# EAGLE schematic boat1 (EAGLE 6.4)
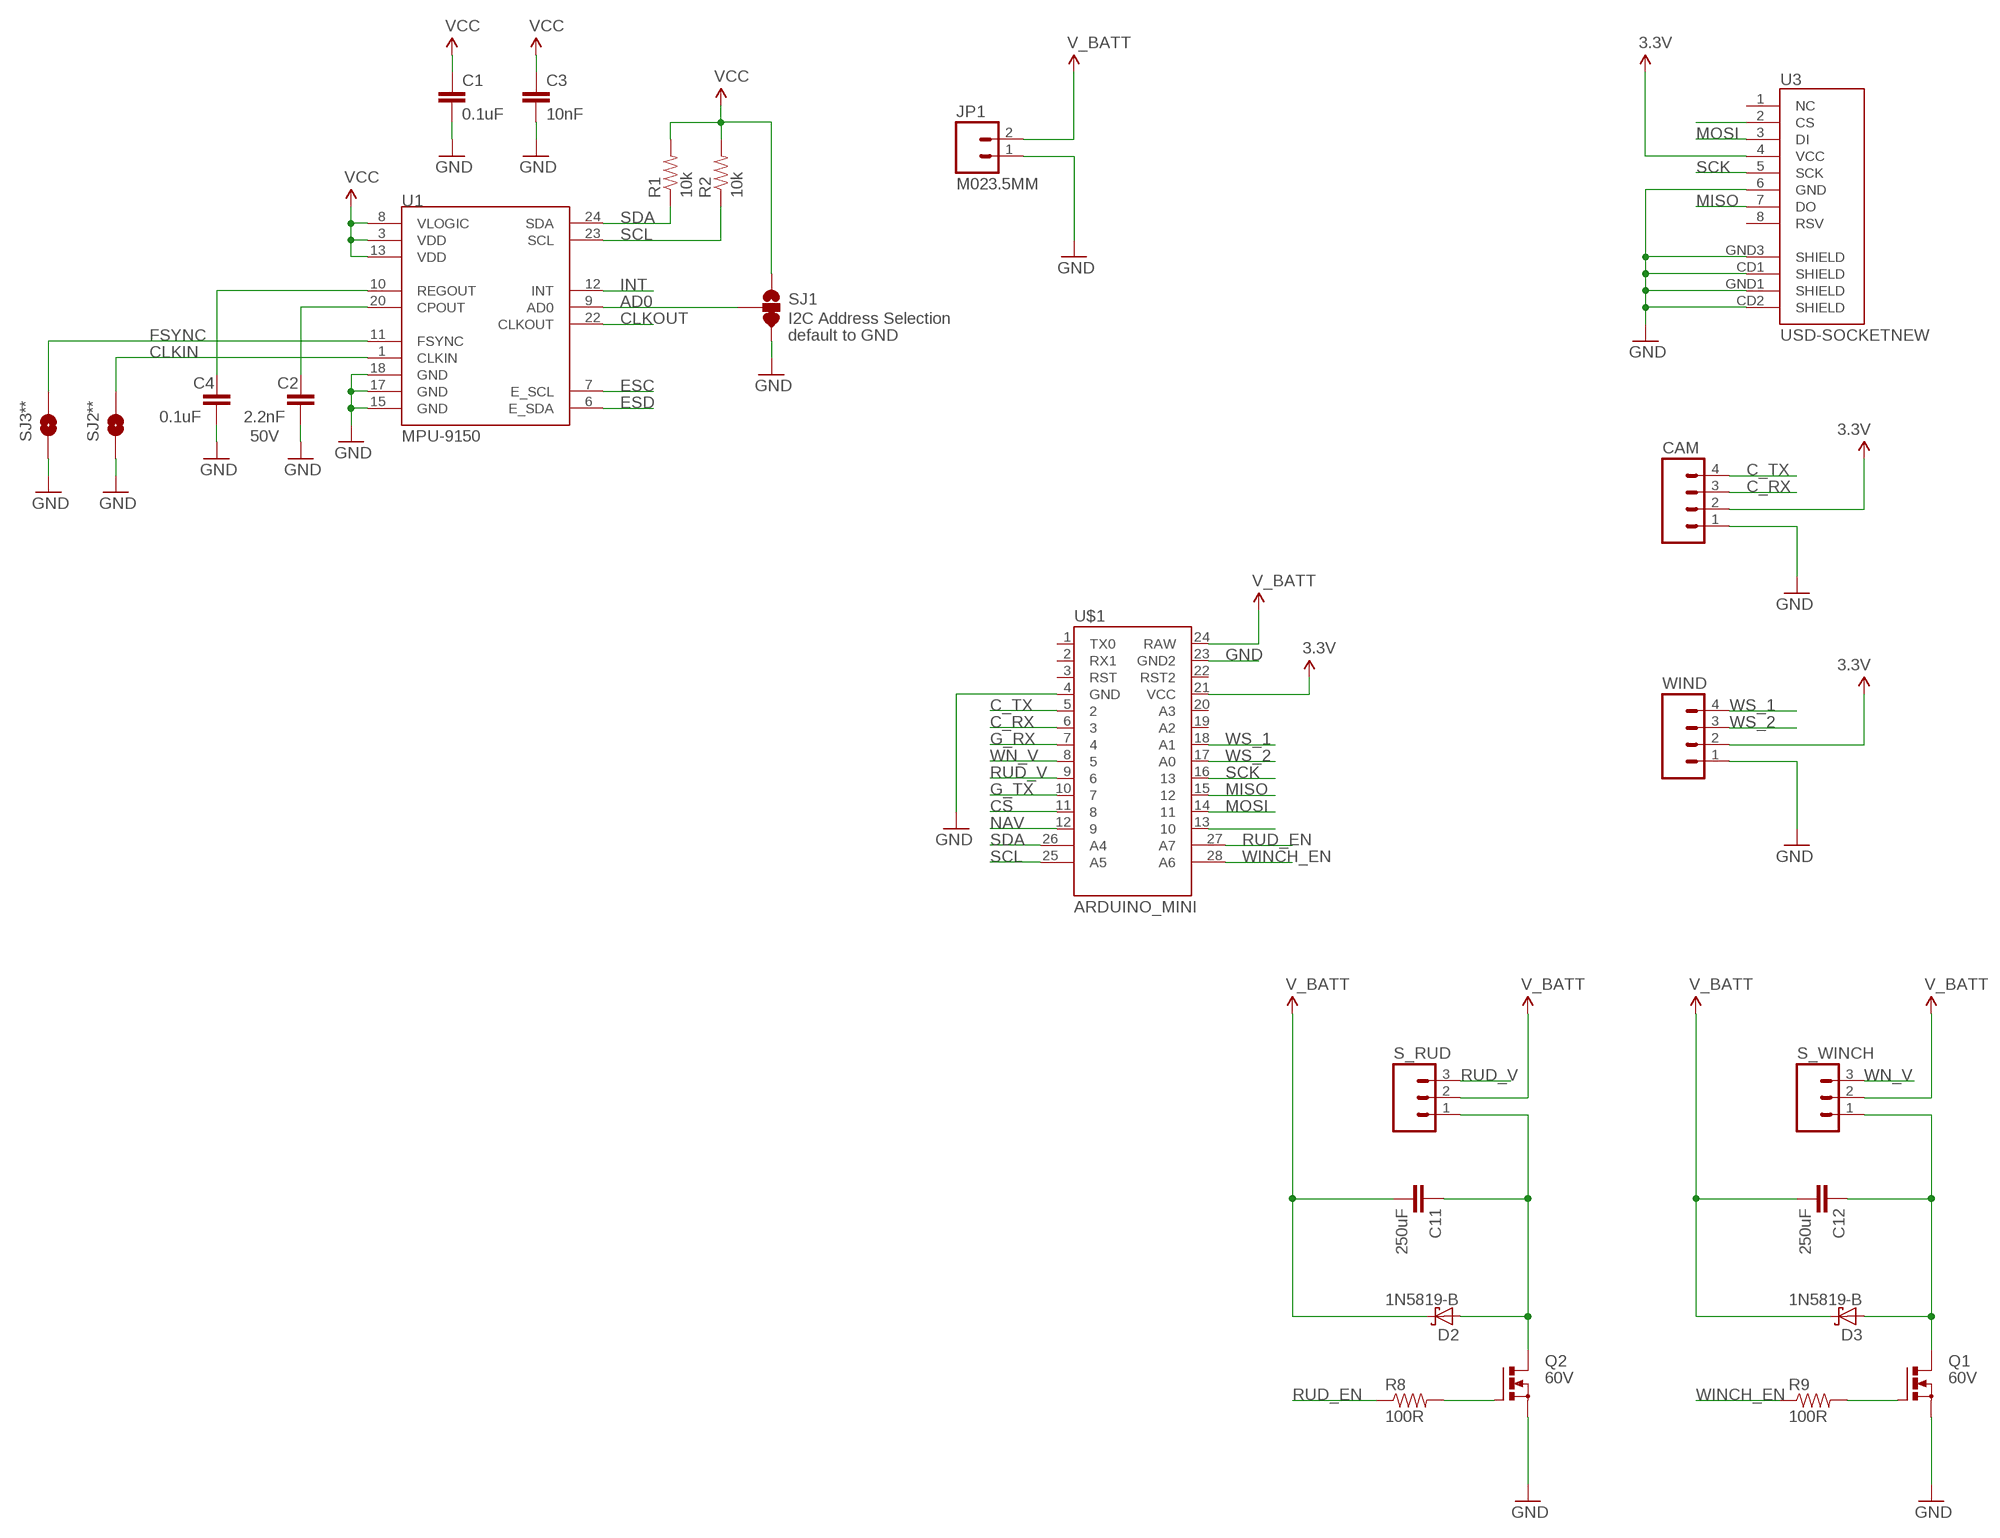
[diagram p0: schematic, sheet 1]

## Parts
C1  0.1uF  CAP0402-CAP  [0402-CAP]
C2  2.2nF  CAP0402-CAP  [0402-CAP]
C3  10nF  CAP0402-CAP  [0402-CAP]
C4  0.1uF  CAP0402-CAP  [0402-CAP]
C11  250uF  CAPPTH1  [CAP-PTH-5MM]
C12  250uF  CAPPTH1  [CAP-PTH-5MM]
CAM  M04PTH  [1X04]
D2  1N5819-B  [DO41-7.6]
D3  1N5819-B  [DO41-7.6]
JP1  M023.5MM  [SCREWTERMINAL-3.5MM-2]
Q1  60V  PMOSFET_NTO220BV  [TO220BV]
Q2  60V  PMOSFET_NTO220BV  [TO220BV]
R1  10k  RESISTOR0402-RES  [0402-RES]
R2  10k  RESISTOR0402-RES  [0402-RES]
R8  100R  RESISTOR0603  [0603-RES]
R9  100R  RESISTOR0603  [0603-RES]
S_RUD  M03PTH  [1X03]
S_WINCH  M03PTH  [1X03]
SJ1  SOLDERJUMPER_2WAYPASTE2&3  [SJ_3_PASTE2&3]
SJ2**  SOLDERJUMPERTRACE  [SJ_2S-TRACE]
SJ3**  SOLDERJUMPERTRACE  [SJ_2S-TRACE]
U1  MPU-9150  MPU-9150QFN-24-NP  [QFN-24-NP]
U3  USD-SOCKETNEW  [MICRO-SD-SOCKET-PP]
U$1  ARDUINO_MINI  [ARDUINO_MINI]
WIND  M04PTH  [1X04]

## Nets
3.3V: C1.1 C3.1 CAM.2 R1.2 R2.2 SJ1.1 U1.3(VDD) U1.8(VLOGIC) U1.13(VDD) U3.4(VCC) U$1.21(VCC) WIND.2 ; supply symbol labelled VCC
AD0: SJ1.2 U1.9(AD0)
C_RX: CAM.3 U$1.6
C_TX: CAM.4 U$1.5
CLKIN: SJ2**.2 U1.1(CLKIN)
CLKOUT: U1.22(CLKOUT)
CS: U$1.11
ESC: U1.7(E_SCL)
ESD: U1.6(E_SDA)
FSYNC: SJ3**.2 U1.11(FSYNC)
G_RX: U$1.7
G_TX: U$1.10
GND: C1.2 C2.2 C3.2 C4.2 CAM.1 JP1.1 Q1.S Q2.S SJ1.3 SJ2**.1 SJ3**.1 U1.15(GND) U1.17(GND) U1.18(GND) U3.6(GND) U3.CD1(SHIELD) U3.CD2(SHIELD) U3.GND1(SHIELD) U3.GND3(SHIELD) U$1.4(GND) U$1.23(GND2) WIND.1
INT: U1.12(INT)
MISO: U3.7(DO) U$1.15
MOSI: U3.3(DI) U$1.14
N$1: C2.1 U1.20(CPOUT)
N$2: C4.1 U1.10(REGOUT)
N$7: Q2.G R8.2
N$8: C12.1 D3.A Q1.D S_WINCH.1
N$9: C11.1 D2.A Q2.D S_RUD.1
N$10: Q1.G R9.2
N$13: U$1.13
N$163: U3.2(CS)
NAV: U$1.12
RUD_EN: R8.1 U$1.27(A7)
RUD_V: S_RUD.3 U$1.9
SCK: U3.5(SCK) U$1.16
SCL: R2.1 U1.23(SCL) U$1.25(A5)
SDA: R1.1 U1.24(SDA) U$1.26(A4)
V_BATT: C11.2 C12.2 D2.C D3.C JP1.2 S_RUD.2 S_WINCH.2 U$1.24(RAW)
WINCH_EN: R9.1 U$1.28(A6)
WN_V: S_WINCH.3 U$1.8
WS_1: U$1.18(A1) WIND.4
WS_2: U$1.17(A0) WIND.3
Unconnected: U3.1(NC) U3.8(RSV) U$1.1(TX0) U$1.2(RX1) U$1.3(RST) U$1.19(A2) U$1.20(A3) U$1.22(RST2)

## Notes on the sheet
- I2C Address Selection
- default to GND
- 50V

## Library data of the parts
C1-C4 = SparkFun-Passives:CAP: Capacitor Standard 0603 ceramic capacitor, and 0.1" leaded capacitor.
C11 C12 = SparkFun-Capacitors:CAP: Capacitor Standard 0603 ceramic capacitor, and 0.1" leaded capacitor.
CAM WIND = SparkFun-Connectors:M04: Header 4 Standard 4-pin 0.1" header. Use with straight break away headers (SKU : PRT-00116), right angle break away headers (PRT-00553), swiss pins (PRT-00743), machine pins (PRT-00117), and female headers (PRT-00115). Molex polarized connector foot print use with SKU : PRT-08231 with associated crimp pins and housings. 1MM SMD Version SKU: PRT-10208
D2 D3 = diode:1N581*: 1.0A SCHOTTKY BARRIER RECTIFIER Source: http://www.diodes.com/datasheets/ds23001.pdf
JP1 = SparkFun-Connectors:M02: Standard 2-pin 0.1" header. Use with - straight break away headers ( PRT-00116) - right angle break away headers (PRT-00553) - swiss pins (PRT-00743) - machine pins (PRT-00117) - female headers (PRT-00115) Molex polarized connector foot print use with: PRT-08233 with associated crimp pins and housings. 2.54_SCREWTERM for use with PRT-10571. 3.5mm Screw Terminal footprints for PRT-08084 5mm Screw Terminal footprints for use with PRT-08433
Q1 Q2 = transistor-power:PMOSFET_N: Power MOSFET N-Channel
R1 R2 = SparkFun-Passives:RESISTOR: Resistor Basic schematic elements and footprints for 0603, 1206, and PTH resistors.
R8 R9 = SparkFun-Resistors:RESISTOR: Resistor Basic schematic elements and footprints for 0603, 1206, and PTH resistors.
S_RUD S_WINCH = SparkFun-Connectors:M03: Header 3 Standard 3-pin 0.1" header. Use with straight break away headers (SKU : PRT-00116), right angle break away headers (PRT-00553), swiss pins (PRT-00743), machine pins (PRT-00117), and female headers (PRT-00115). Molex polarized connector foot print use with SKU : PRT-08232 with associated crimp pins and housings.
SJ1 = SparkFun-Passives:SOLDERJUMPER_2WAY: Solder Jumper 2 way solder jumper
SJ2** SJ3** = SparkFun-Passives:SOLDERJUMPER: Solder Jumper Standard SMD solder jumper. Used to automate production. Two varients : Normally Open and Normally Closed are the same, but have different paste layers. NC will have a large amount of paste and should jumper during reflow.
U1 = SparkFun-Sensors:MPU-9150: 9DOF (3mag, 3accel, 3rotat). I2C interface.
U3 = SparkFun:USD-SOCKET: microSD Socket Push-push type uSD socket. Schematic element and footprint production proven. Spark Fun Electronics SKU : PRT-00127. tDoc lines correctly indicate media card edge positions when inserting (unlocked, locked, depressed).
U$1 = custom_mini:ARDUINO_MINI: Arduino Pro Mini footprint